# EAGLE schematic STM32F050F Base (EAGLE 6.5.0)
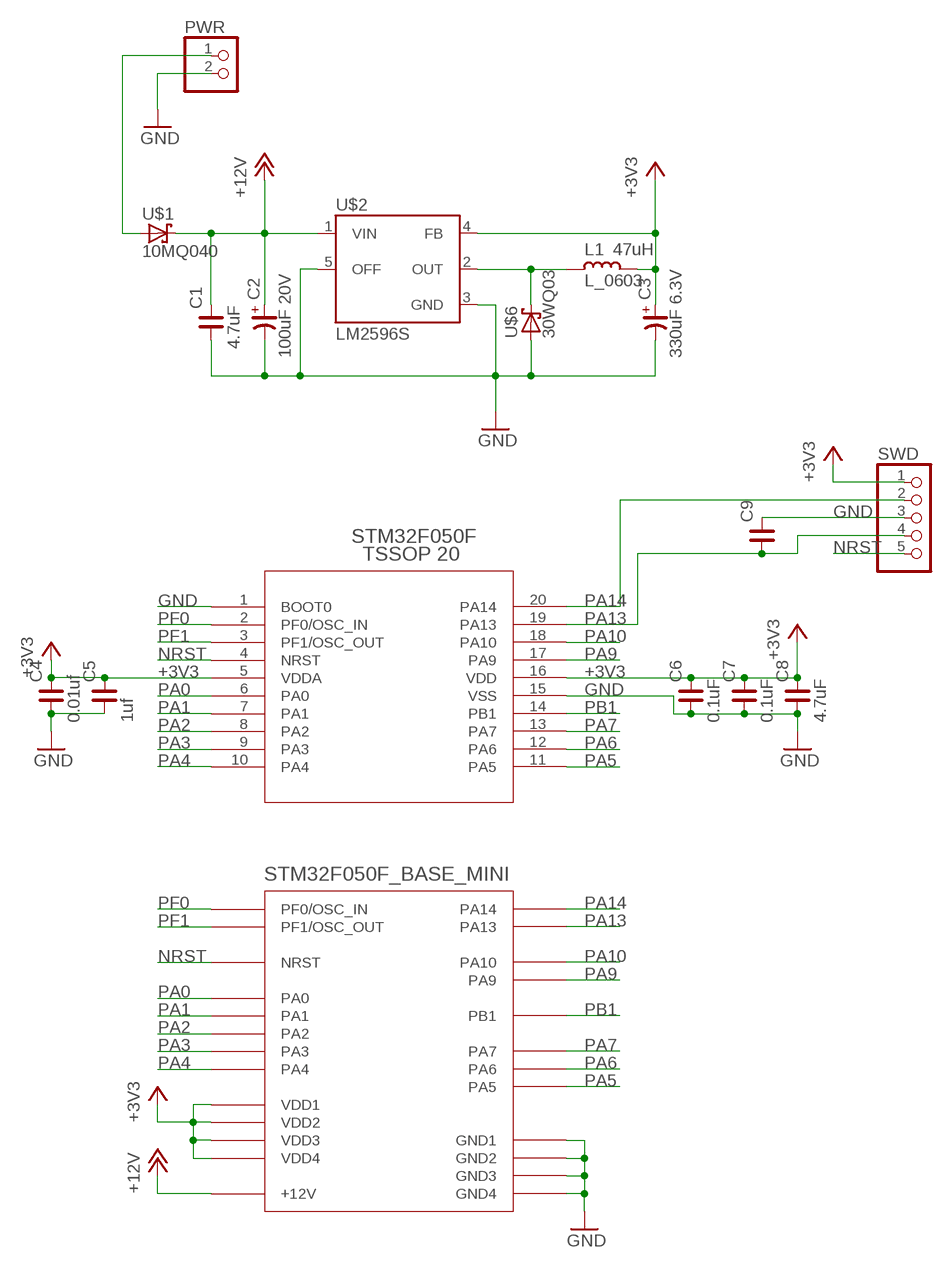
[diagram p0: schematic, sheet 1]

## Parts
C1  4.7uF  C_1206  [C1206]
C2  100uF 20V  CP_7343  [C7343/T]
C3  330uF 6.3V  CP_7343  [C7343/T]
C4  0.01uf  C_0805  [C0805]
C5  1uf  C_0805  [C0805]
C6  0.1uF  C_0805  [C0805]
C7  0.1uF  C_0805  [C0805]
C8  4.7uF  C_1206  [C1206]
C9  C_1206  [C1206]
L1  L_0603  [L0603]
PWR  PINHD-1X02_2.54-90°-S  [1X02/90-S]
SWD  PINHD-1X05_2.54-90°-S  [1X05/90-S]
U$1  10MQ040  [SMA]
U$2  LM2596S  [TO263-5]
U$3  STM32F050F_BASE_MINI  [STM32_BASE_MINI]
U$4  STM32F050F4P6  [TSSOP20]
U$6  30WQ03  [TO252]

## Nets
+3V3: C3.+ C4.2 C5.2 C6.2 C7.2 C8.2 L1.1 SWD.1 U$2.4(FB) U$3.VDD1 U$3.VDD2 U$3.VDD3 U$3.VDD4 U$4.5(VDDA) U$4.16(VDD)
+12V: C1.2 C2.+ U$1.C U$2.1(VIN) U$3.+12V
GND: C1.1 C2.- C3.- C4.1 C5.1 C6.1 C7.1 C8.1 C9.2 PWR.2 SWD.3 U$2.3(GND) U$2.5(OFF) U$3.GND1 U$3.GND2 U$3.GND3 U$3.GND4 U$4.1(BOOT0) U$4.15(VSS) U$6.1(A) U$6.2(A)
N$23: PWR.1 U$1.A
N$34: L1.2 U$2.2(OUT) U$6.3(C)
NRST: SWD.5 U$3.NRST U$4.4(NRST)
PA0: U$3.PA0 U$4.6(PA0)
PA1: U$3.PA1 U$4.7(PA1)
PA2: U$3.PA2 U$4.8(PA2)
PA3: U$3.PA3 U$4.9(PA3)
PA4: U$3.PA4 U$4.10(PA4)
PA5: U$3.PA5 U$4.11(PA5)
PA6: U$3.PA6 U$4.12(PA6)
PA7: U$3.PA7 U$4.13(PA7)
PA9: U$3.PA9 U$4.17(PA9)
PA10: U$3.PA10 U$4.18(PA10)
PA13: C9.1 SWD.4 U$3.PA13 U$4.19(PA13)
PA14: SWD.2 U$3.PA14 U$4.20(PA14)
PB1: U$3.PB1 U$4.14(PB1)
PF0: U$3.PF0(PF0/OSC_IN) U$4.2(PF0/OSC_IN)
PF1: U$3.PF1(PF1/OSC_OUT) U$4.3(PF1/OSC_OUT)

## Library data of the parts
C1 C4-C9 = rc-master-smd:C_: NON-POLARIZED CAP
C2 C3 = rc-master-smd:CP_: POLARIZED CAP
L1 = rc-master-smd:L_: INDUCTOR; LCN0603T-47NJ-N: 47uH
PWR = pinhead-2:PINHD-1X02: PIN HEADER
SWD = pinhead-2:PINHD-1X05: PIN HEADER
U$1 = my-library:10MQ040: SCHOTTKY
U$2 = my-library:LM2596: LM2596
U$3 = my-library:STM32F050F_BASE_MINI
U$4 = STM32F0:STM32F050F4P6: STM32F050F4P6
U$6 = my-library:30WQ03